# Altium schematic sheet Buck converter.SchDoc
size A4; SheetNumber: 1; SheetTotal: 1
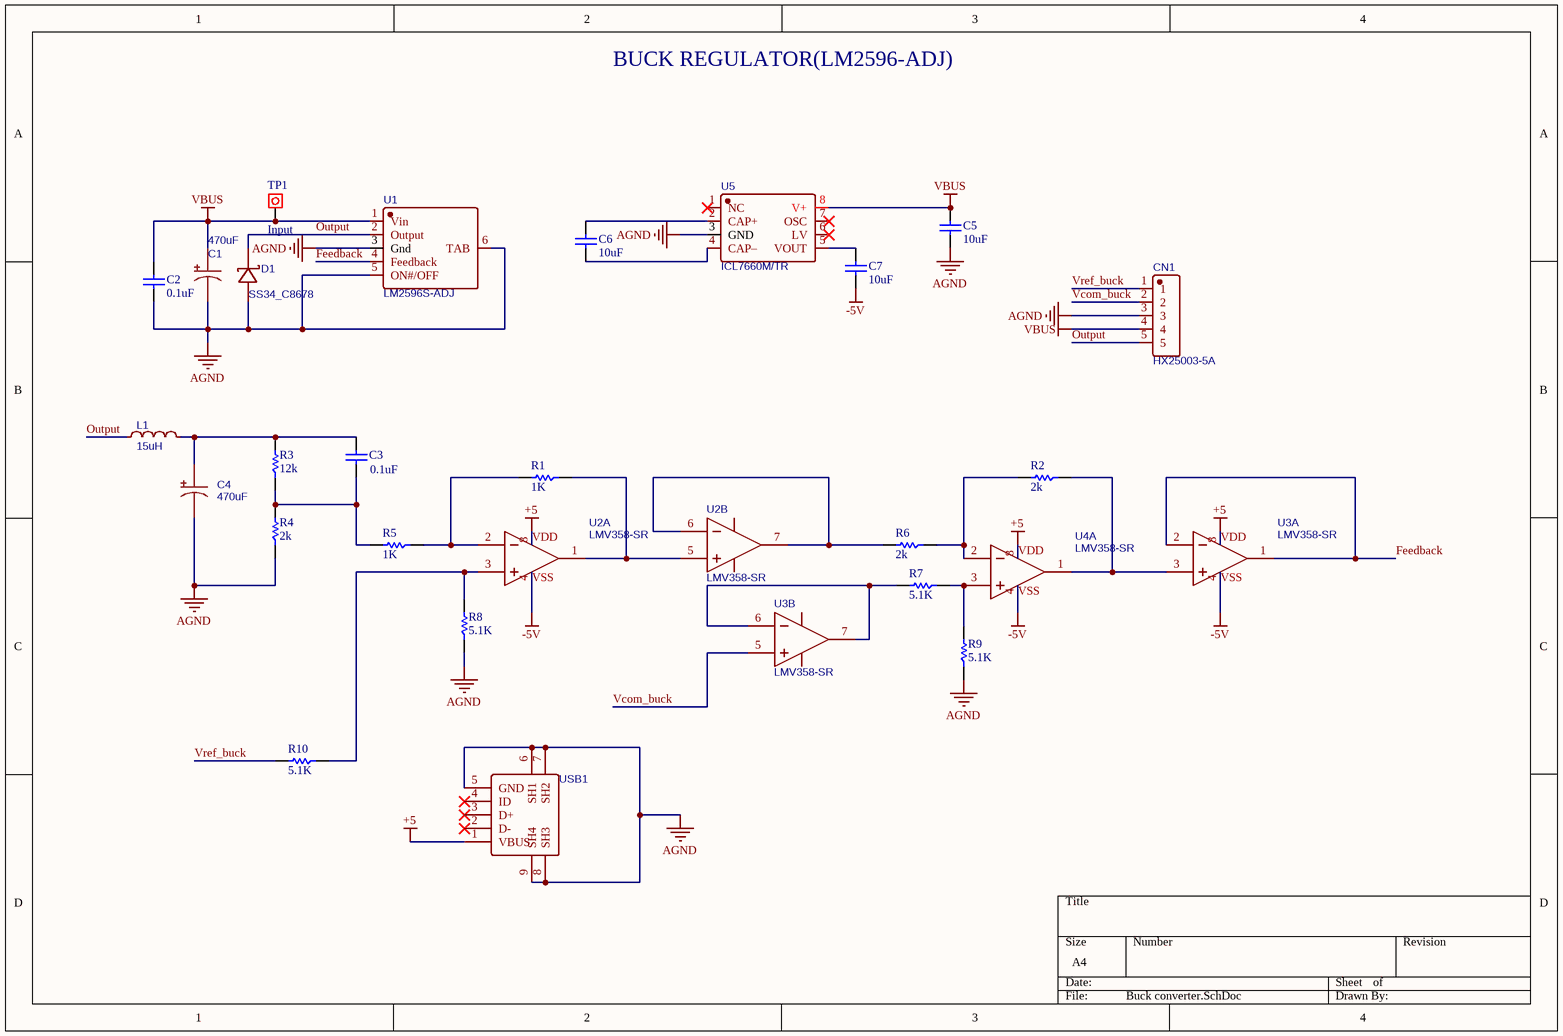
[diagram p0: Buck converter.SchDoc]

## Parts
C1  470uF  [CAP-SMD_BD12.5-L13.0-W13.0-RD]
C2  0.1uF  [0805C]
C3  0.1uF  [0805C]
C4  470uF  [CAP-SMD_BD12.5-L13.0-W13.0-RD]
C5  10uF  [0805C]
C6  10uF  [0805C]
C7  10uF  [0805C]
CN1  HX25003-5A  [CONN-TH_5P-P2.50_HX25003-5A]
D1  SS34_C8678  [DO-214AC_L4.3-W2.7-LS5.3-RD]
L1  15uH  [IND-SMD_L11.5-W10.5_MWSA1004]
R1  1K  [0805]
R2  2k  [0805]
R3  12k  [0805]
R4  2k  [0805]
R5  1K  [0805]
R6  2k  [0805]
R7  5.1K  [0805]
R8  5.1K  [0805]
R9  5.1K  [0805]
R10  5.1K  [0805]
TP1  INPUT  [Testpoin]
U1  LM2596S-ADJ  [TO-263-5_L10.2-W8.9-P1.70-BR]
U2  LMV358-SR  [SOP-8_L4.9-W3.9-P1.27-LS6.0-BL]  (parts A,B of 2)
U3  LMV358-SR  [SOP-8_L4.9-W3.9-P1.27-LS6.0-BL]  (parts A,B of 2)
U4  LMV358-SR  [SOP-8_L4.9-W3.9-P1.27-LS6.0-BL]  (part A of 2)
U5  ICL7660M/TR  [SOP-8_L4.9-W3.9-P1.27-LS6.0-BL]
USB1  microUSB  [MICRO-USB-SMD_MICROXNJ]  (value not drawn)

## Nets
+5: U2.8(VDD) U3.8(VDD) U4.8(VDD) USB1.1(VBUS)
-5V: C7.2 U2.4(VSS) U3.4(VSS) U4.4(VSS)
AGND: C1.2 C2.2 C4.2 C5.2 CN1.3 D1.2(A) R4.1 R8.1 R9.1 U1.3(Gnd) U1.5(ON#/OFF) U1.6(TAB) U5.3(GND) USB1.5(GND) USB1.6(SH1) USB1.7(SH2) USB1.8(SH3) USB1.9(SH4)
VBUS: C1.1 C2.1 C5.1 CN1.4 TP1.1 U1.1(Vin) U5.8(V+)
Feedback: U1.4(Feedback) U3.1(OUTA) U3.2(INA-)
Output: CN1.5 D1.1(K) L1.1 U1.2(Output)
Vcom_buck: CN1.2 U3.5(INB+)
Vref_buck: CN1.1 R10.2
NetC3_1: C3.1 C4.1 L1.2 R3.2
NetC3_2: C3.2 R3.1 R4.2 R5.2
NetC6_1: C6.1 U5.2(CAP+)
NetC6_2: C6.2 U5.4(CAP–)
NetC7_1: C7.1 U5.5(VOUT)
NetR1_1: R1.1 U2.1(OUTA) U2.5(INB+)
NetR1_2: R1.2 R5.1 U2.2(INA-)
NetR2_1: R2.1 U3.3(INA+) U4.1(OUTA)
NetR2_2: R2.2 R6.1 U4.2(INA-)
NetR6_2: R6.2 U2.6(INB-) U2.7(OUTB)
NetR7_1: R7.1 R9.2 U4.3(INA+)
NetR7_2: R7.2 U3.6(INB-) U3.7(OUTB)
NetR8_2: R8.2 R10.1 U2.3(INA+)

Not connected (* = marked no-connect by the designer): U5 1(NC)* 6(LV)* 7(OSC)*; USB1 2(D-)* 3(D+)* 4(ID)*

## Notes on the sheet
- BUCK REGULATOR(LM2596-ADJ)

## Library data of the parts
C1 C4 = 470uF: BOM_Manufacturer: ROQANG; BOM_Manufacturer Part: RVT1H471M1213; nameAlias: Capacitance; BOM_Supplier: LCSC; BOM_Supplier Part: C90272; BOM_JLCPCB Part Class: Extended Part; spicePre: C; spiceSymbolName: RVT1H471M1213
C2 C3 = C_0.1uf: Capacitor; Reviewed by: RM - 2018/08/05; Revision: July-2002: Re-released for DXP Platform.; Supplier 1: *; Supplier Part Number 1: *; Value: 0.1uF
C5-C7 = C_10uf: Capacitor; Reviewed by: RM - 2018/08/05; Revision: July-2002: Re-released for DXP Platform.; Supplier 1: *; Supplier Part Number 1: *; Value: 10uF
CN1 = HX25003-5A: BOM_Manufacturer: HX(Zhejiang Yueqing Hongxing Elec); Contributor: LCSC; BOM_Supplier: LCSC; BOM_Supplier Part: C442302; BOM_Manufacturer Part: HX25003-5A; BOM_JLCPCB Part Class: Extended Part; spicePre: C; spiceSymbolName: HX25003-5A
D1 = SS34_C8678: BOM_Manufacturer Part: SS34; BOM_Manufacturer: MDD; BOM_Supplier: LCSC; BOM_Supplier Part: C8678; BOM_JLCPCB Part Class: Basic Part; spicePre: D; spiceSymbolName: SS34_C8678
L1 = 15uH: BOM_Manufacturer: Sunlord; BOM_Manufacturer Part: MWSA1004-150MT; nameAlias: Inductance; Contributor: LCSC; BOM_Supplier: LCSC; BOM_Supplier Part: C151872; BOM_JLCPCB Part Class: Extended Part; spicePre: L; spiceSymbolName: MWSA1004-150MT
R1 R5 = R_1k: Resistor; Reviewed by: RM - 2018/08/05; Supplier 1: *; Suppler Part Number 1: *; Value: 1K
R2 R4 R6 = R_2k: Resistor; Reviewed by: RM - 2018/08/05; Supplier 1: *; Suppler Part Number 1: *; Value: 2k
R3 = R_12k: Resistor; Reviewed by: RM - 2018/08/05; Supplier 1: *; Suppler Part Number 1: *; Value: 12k
R7-R10 = R_5.1k: Resistor; Reviewed by: RM - 2018/08/05; Supplier 1: *; Suppler Part Number 1: *; Value: 5.1K
TP1 = Test Point: Pad; Value: Input
U1 = LM2596S-ADJ: BOM_Manufacturer: UMW(Youtai Semiconductor Co., Ltd.); Contributor: LCSC; BOM_Supplier: LCSC; BOM_Supplier Part: C347423; BOM_Manufacturer Part: LM2596S-ADJ; BOM_JLCPCB Part Class: Extended Part; spicePre: U; spiceSymbolName: LM2596S-ADJ
U2-U4 = LMV358-SR: BOM_Manufacturer: Gainsil; subpart_no: 2; BOM_Supplier: LCSC; BOM_Supplier Part: C362274; BOM_Manufacturer Part: LMV358-SR; BOM_JLCPCB Part Class: Extended Part; spicePre: U; spiceSymbolName: LMV358-SR
U5 = ICL7660M/TR: BOM_Manufacturer: HGSEMI; Contributor: LCSC; BOM_Supplier: LCSC; BOM_Supplier Part: C356724; BOM_Manufacturer Part: ICL7660M/TR; BOM_JLCPCB Part Class: Extended Part; spicePre: U; spiceSymbolName: ICL7660M/TR
USB1 = MICROXNJ: BOM_Manufacturer: SHOU HAN; Contributor: LCSC; BOM_Supplier: LCSC; BOM_Supplier Part: C404969; BOM_Manufacturer Part: MicroXNJ; BOM_JLCPCB Part Class: Extended Part; spicePre: U; spiceSymbolName: MICROXNJ